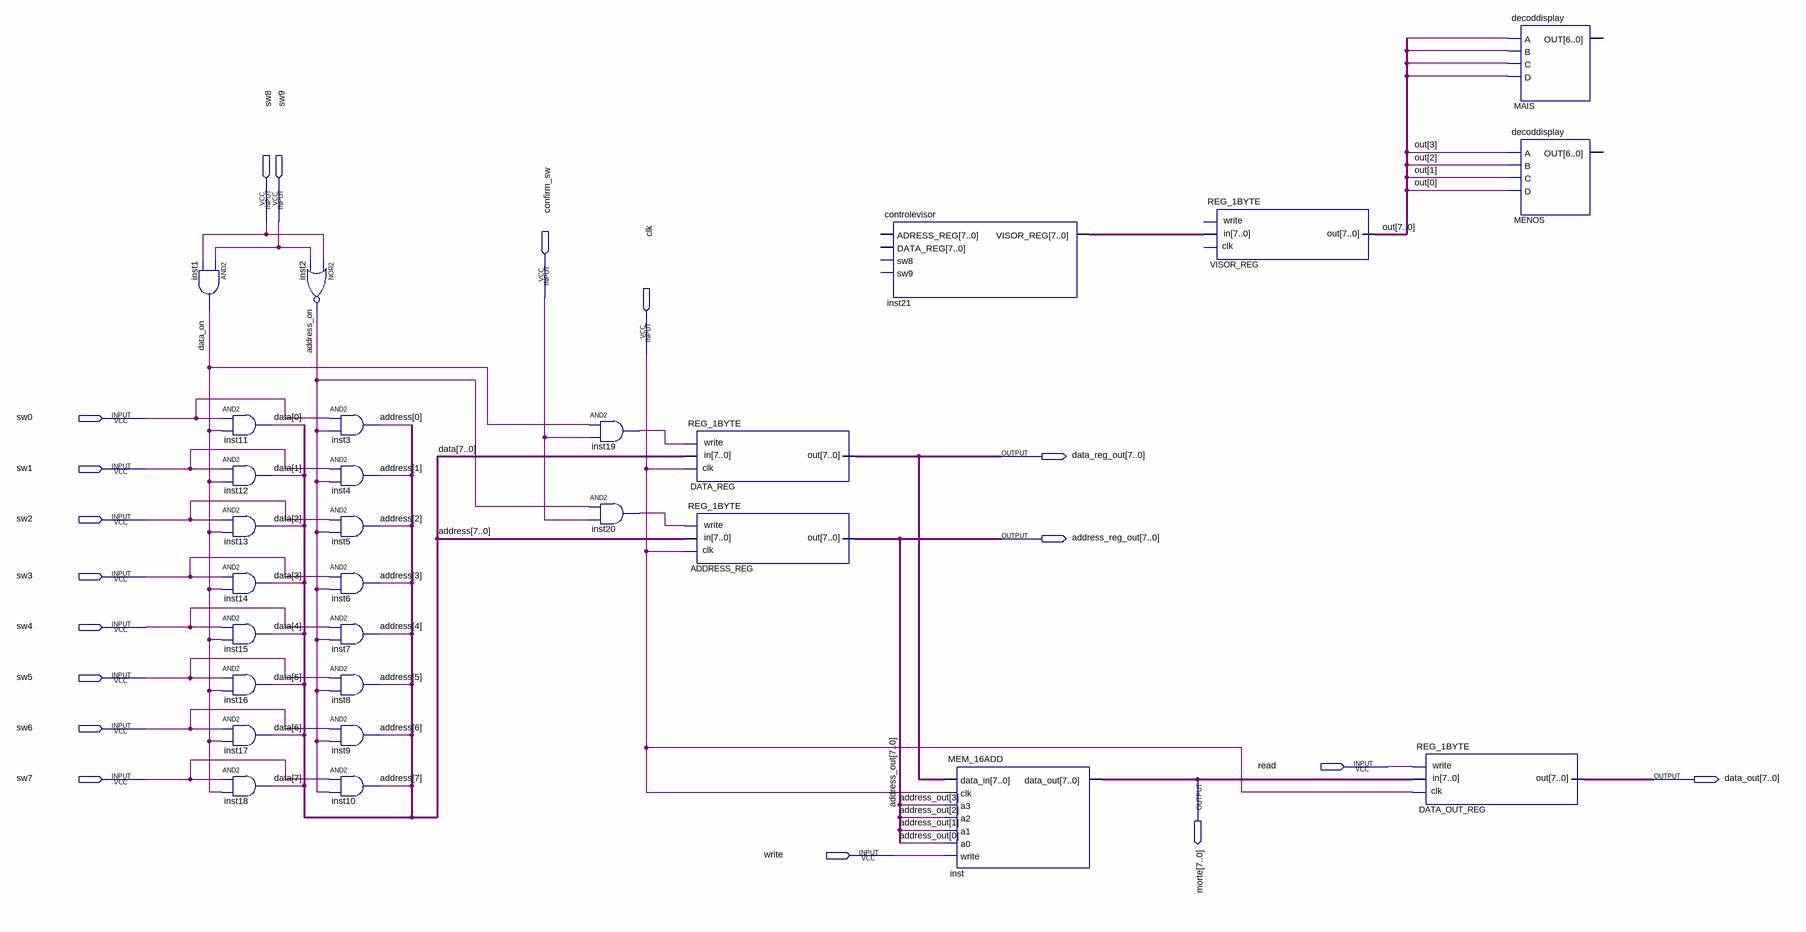
[diagram p0: schematic sheet]
// Quartus schematic trabalhofinal.bdf as structural Verilog: 28 symbols, 18 pins
module trabalhofinal (
  input  sw8,
  input  sw9,
  input  confirm_sw,
  input  clk,
  input  sw0,
  input  sw1,
  input  sw2,
  input  sw3,
  input  sw4,
  input  sw5,
  input  sw6,
  input  read,
  input  sw7,
  input  write,
  output [7:0] data_reg_out,
  output [7:0] address_reg_out,
  output [7:0] morte,
  output [7:0] data_out
);

  wire address_on, data_on, inst19_out, inst20_out, undriven, undriven_2, undriven_3, undriven_4;
  wire [7:0] address, data, inst21_visor_reg, out;

  and inst1 (data_on, sw9, sw8);
  and inst11 (data[0], sw0, data_on);
  and inst12 (data[1], sw1, data_on);
  and inst13 (data[2], sw2, data_on);
  and inst14 (data[3], sw3, data_on);
  and inst15 (data[4], sw4, data_on);
  and inst16 (data[5], sw5, data_on);
  and inst17 (data[6], sw6, data_on);
  and inst18 (data[7], sw7, data_on);
  nor inst2 (address_on, sw8, sw9);
  and inst3 (address[0], sw0, address_on);
  and inst4 (address[1], sw1, address_on);
  and inst5 (address[2], sw2, address_on);
  and inst6 (address[3], sw3, address_on);
  and inst7 (address[4], sw4, address_on);
  and inst8 (address[5], sw5, address_on);
  and inst9 (address[6], sw6, address_on);
  and inst10 (address[7], sw7, address_on);
  and inst19 (inst19_out, data_on, confirm_sw);
  and inst20 (inst20_out, address_on, confirm_sw);
  REG_1BYTE DATA_REG (.write(inst19_out), .clk(clk), .in(data), .out(data_reg_out));
  REG_1BYTE ADDRESS_REG (.write(inst20_out), .clk(clk), .in(address), .out(address_reg_out));
  controlevisor inst21 (.VISOR_REG(inst21_visor_reg));  // open: ADRESS_REG, DATA_REG, sw8, sw9
  MEM_16ADD inst (
    .data_in(data_reg_out), .clk(clk), .a3(address_reg_out[3]), .a2(address_reg_out[2]),
    .a1(address_reg_out[1]), .a0(address_reg_out[0]), .write(write), .data_out(morte));
  REG_1BYTE VISOR_REG (.in(inst21_visor_reg), .out(out));  // open: write, clk
  REG_1BYTE DATA_OUT_REG (.write(read), .clk(clk), .in(morte), .out(data_out));
  decoddisplay MAIS (.A(undriven_4), .B(undriven_3), .C(undriven_2), .D(undriven));  // open: OUT
  decoddisplay MENOS (.A(out[3]), .B(out[2]), .C(out[1]), .D(out[0]));  // open: OUT

  // Other names for the same wires on the sheet: address_out[7:0] = address_reg_out
endmodule
